# EAGLE schematic SKEMATIK BOARD 24V (06-07-2025) (EAGLE 9.7.0)
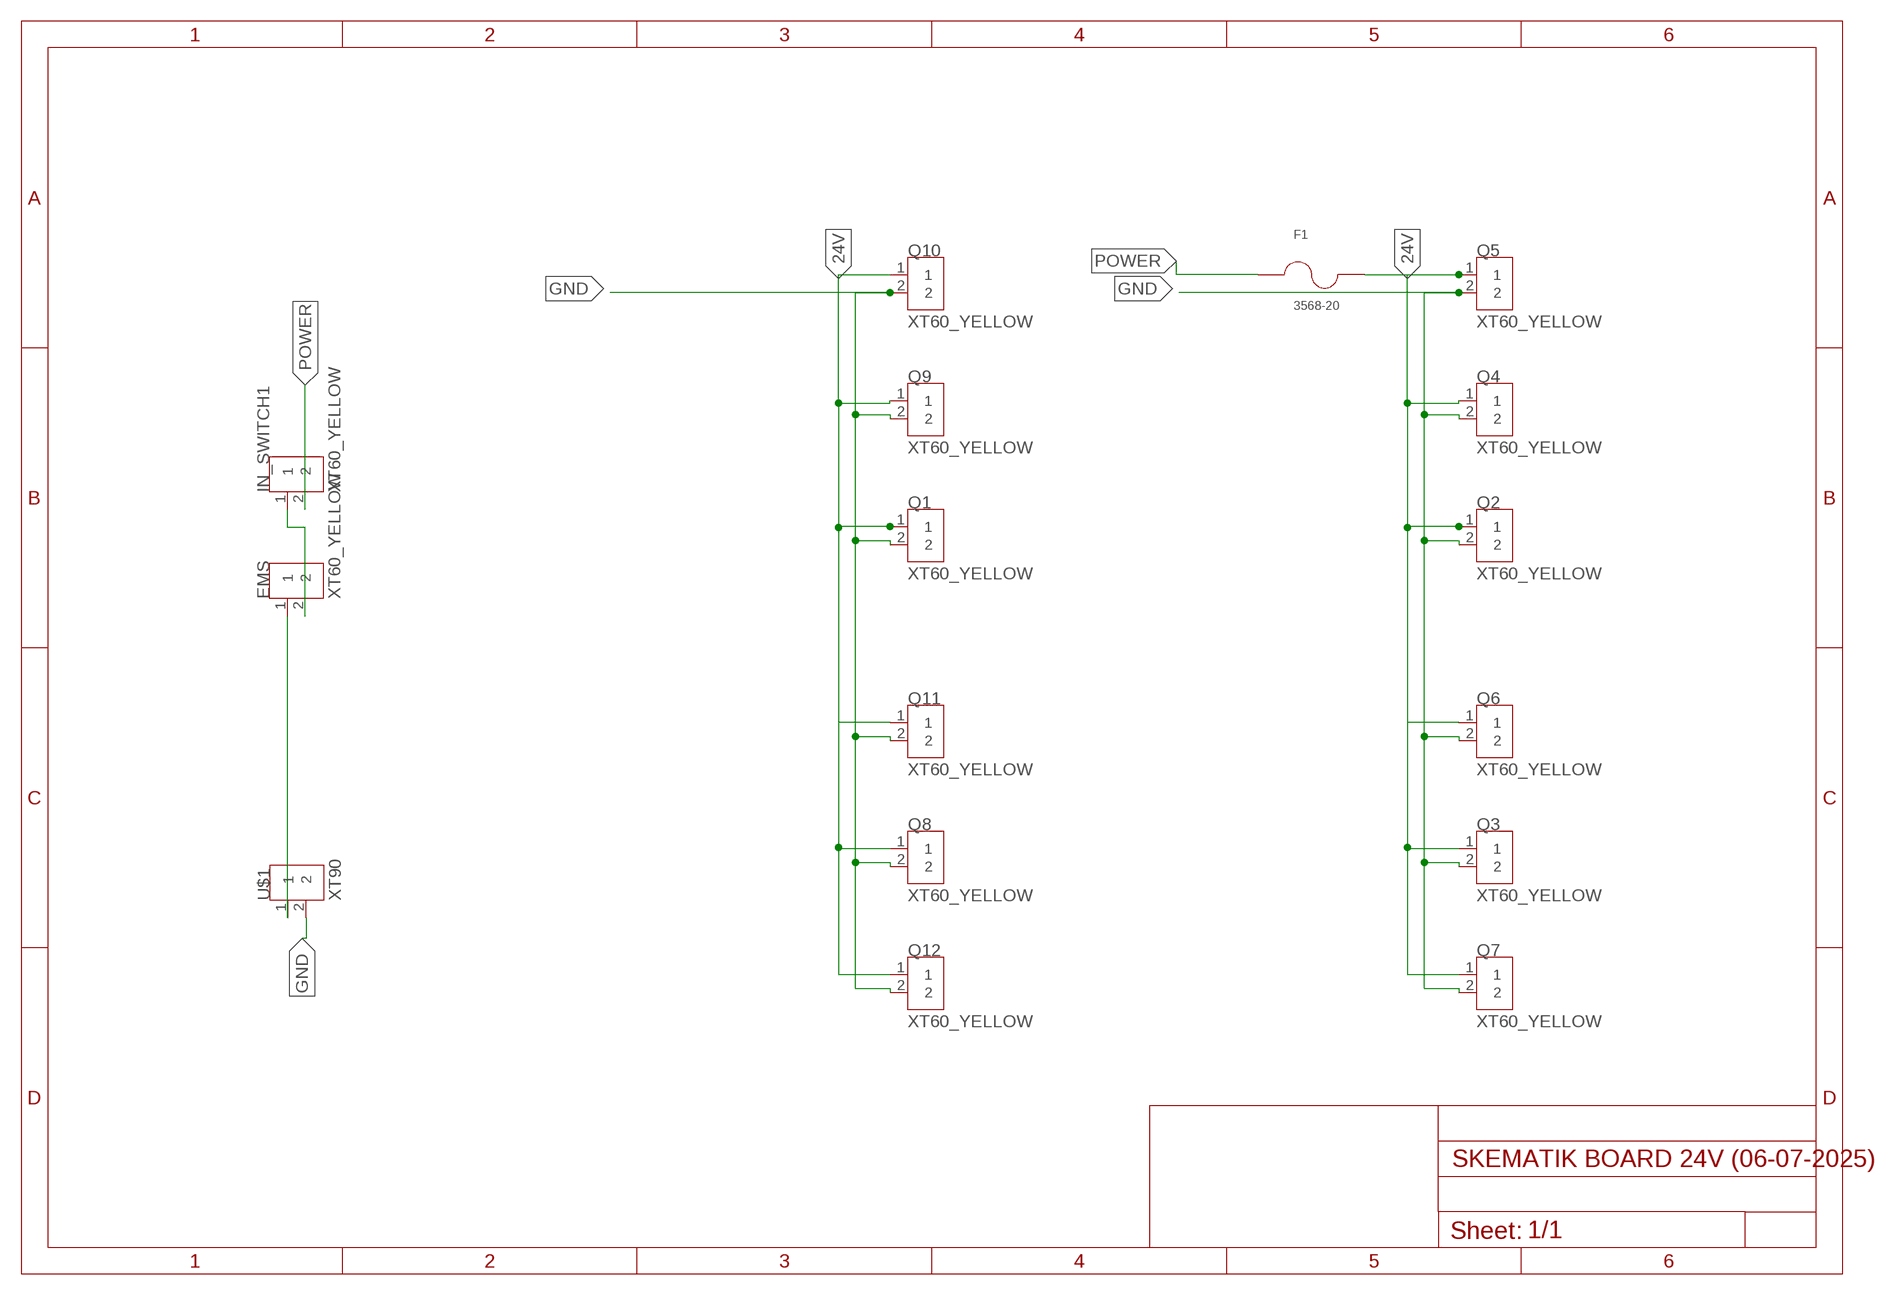
[diagram p0: schematic, sheet 1]

## Parts
EMS  XT60_YELLOW  [AMASS_XT60PB-M]
F1  3568-20  [FUSE_3568-20]
IN_SWITCH1  XT60_YELLOW  [AMASS_XT60PB-M]
Q1  XT60_YELLOW  [AMASS_XT60PB-M]
Q2  XT60_YELLOW  [AMASS_XT60PB-M]
Q3  XT60_YELLOW  [AMASS_XT60PB-M]
Q4  XT60_YELLOW  [AMASS_XT60PB-M]
Q5  XT60_YELLOW  [AMASS_XT60PB-M]
Q6  XT60_YELLOW  [AMASS_XT60PB-M]
Q7  XT60_YELLOW  [AMASS_XT60PB-M]
Q8  XT60_YELLOW  [AMASS_XT60PB-M]
Q9  XT60_YELLOW  [AMASS_XT60PB-M]
Q10  XT60_YELLOW  [AMASS_XT60PB-M]
Q11  XT60_YELLOW  [AMASS_XT60PB-M]
Q12  XT60_YELLOW  [AMASS_XT60PB-M]
U$1  XT90  [AMASS_XT90PB-M]

## Nets
24V: F1.2 F1.4 Q1.1 Q2.1 Q3.1 Q4.1 Q5.1 Q6.1 Q7.1 Q8.1 Q9.1 Q10.1 Q11.1 Q12.1
GND: Q1.2 Q2.2 Q3.2 Q4.2 Q5.2 Q6.2 Q7.2 Q8.2 Q9.2 Q10.2 Q11.2 Q12.2 U$1.2
N$1: EMS.1 U$1.1
N$4: EMS.2 IN_SWITCH1.1
POWER: F1.1 F1.3 IN_SWITCH1.2

## Library data of the parts
EMS IN_SWITCH1 Q1-Q12 = XT60_YELLOW:XT60_YELLOW: Check availability <https://pricing.snapeda.com/parts/XT60%20YELLOW/Pololu/view-part?ref=eda>; AVAILABILITY: Not in stock; CHECK_PRICES: https://www.snapeda.com/parts/XT60%20YELLOW/Pololu/view-part/?ref=eda; DESCRIPTION: Power connector; 65A; PIN: 2; Colour: yellow; MF: Pololu; MP: XT60 YELLOW; PACKAGE: None; PRICE: None; SNAPEDA_LINK: https://www.snapeda.com/parts/XT60%20YELLOW/Pololu/view-part/?ref=snap
F1 = 3568-20:3568-20: Check availability <https://pricing.snapeda.com/parts/356820/Keystone%20Electronics/view-part?ref=eda>; AVAILABILITY: In Stock; CHECK_PRICES: https://www.snapeda.com/parts/356820/Keystone/view-part/?ref=eda; DESCRIPTION: Fuse Holder 30 A 500V 1 Circuit Blade Through Hole; MF: Keystone Electronics; MP: 356820; PACKAGE: None; PRICE: None; SNAPEDA_LINK: https://www.snapeda.com/parts/356820/Keystone/view-part/?ref=snap
U$1 = XT60_YELLOW:XT90